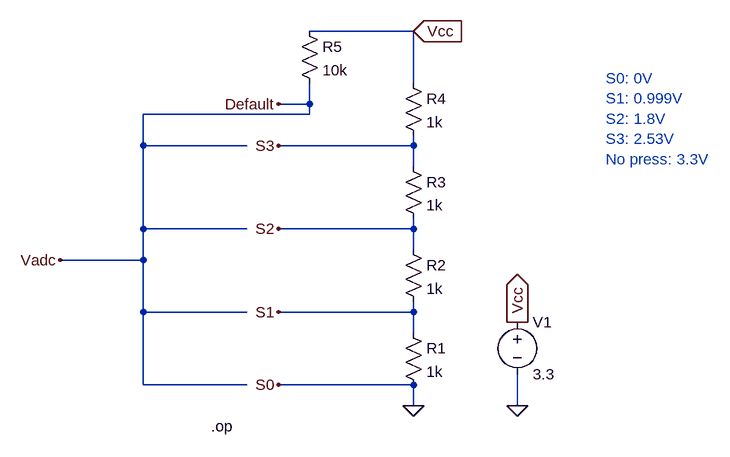
[diagram p0: schematic buttons.asc]
buttons.asc, the LTspice schematic file:
Version 4
SHEET 1 880 680
WIRE 272 -272 112 -272
WIRE 272 -192 272 -272
WIRE 112 -160 112 -192
WIRE 112 -160 64 -160
WIRE 112 -144 112 -160
WIRE 112 -144 -144 -144
WIRE -144 -96 -144 -144
WIRE 16 -96 -144 -96
WIRE 272 -96 272 -112
WIRE 272 -96 64 -96
WIRE 272 -64 272 -96
WIRE -144 32 -144 -96
WIRE 16 32 -144 32
WIRE 272 32 272 16
WIRE 272 32 64 32
WIRE 272 64 272 32
WIRE -144 80 -144 32
WIRE -144 80 -272 80
WIRE -144 160 -144 80
WIRE 16 160 -144 160
WIRE 272 160 272 144
WIRE 272 160 64 160
WIRE 272 192 272 160
WIRE -144 272 -144 160
WIRE 16 272 -144 272
WIRE 272 272 64 272
WIRE 272 304 272 272
WIRE 432 304 432 256
FLAG 272 304 0
FLAG 432 304 0
FLAG 432 176 Vcc
IOPIN 432 176 Out
FLAG 272 -272 Vcc
IOPIN 272 -272 In
FLAG 64 272 S0
FLAG 64 160 S1
FLAG 64 32 S2
FLAG 64 -96 S3
FLAG 64 -160 Default
FLAG -272 80 Vadc
SYMBOL voltage 432 160 R0
WINDOW 123 0 0 Left 0
WINDOW 39 0 0 Left 0
SYMATTR InstName V1
SYMATTR Value 3.3
SYMBOL res 256 176 R0
SYMATTR InstName R1
SYMATTR Value 1k
SYMBOL res 256 48 R0
SYMATTR InstName R2
SYMATTR Value 1k
SYMBOL res 256 -80 R0
SYMATTR InstName R3
SYMATTR Value 1k
SYMBOL res 256 -208 R0
SYMATTR InstName R4
SYMATTR Value 1k
SYMBOL res 96 -288 R0
SYMATTR InstName R5
SYMATTR Value 10k
TEXT -40 336 Left 2 !.op
TEXT 568 -200 Left 2 ;S0: 0V\nS1: 0.999V\nS2: 1.8V\nS3: 2.53V\nNo press: 3.3V

The netlist it stands for:
* buttons.asc
V1 Vcc 0 3.3
R1 S1 0 1k
R2 S2 S1 1k
R3 S3 S2 1k
R4 Vcc S3 1k
R5 Vcc Vadc 10k
.op
* S0: 0V
* S1: 0.999V
* S2: 1.8V
* S3: 2.53V
* No press: 3.3V
.backanno
.end